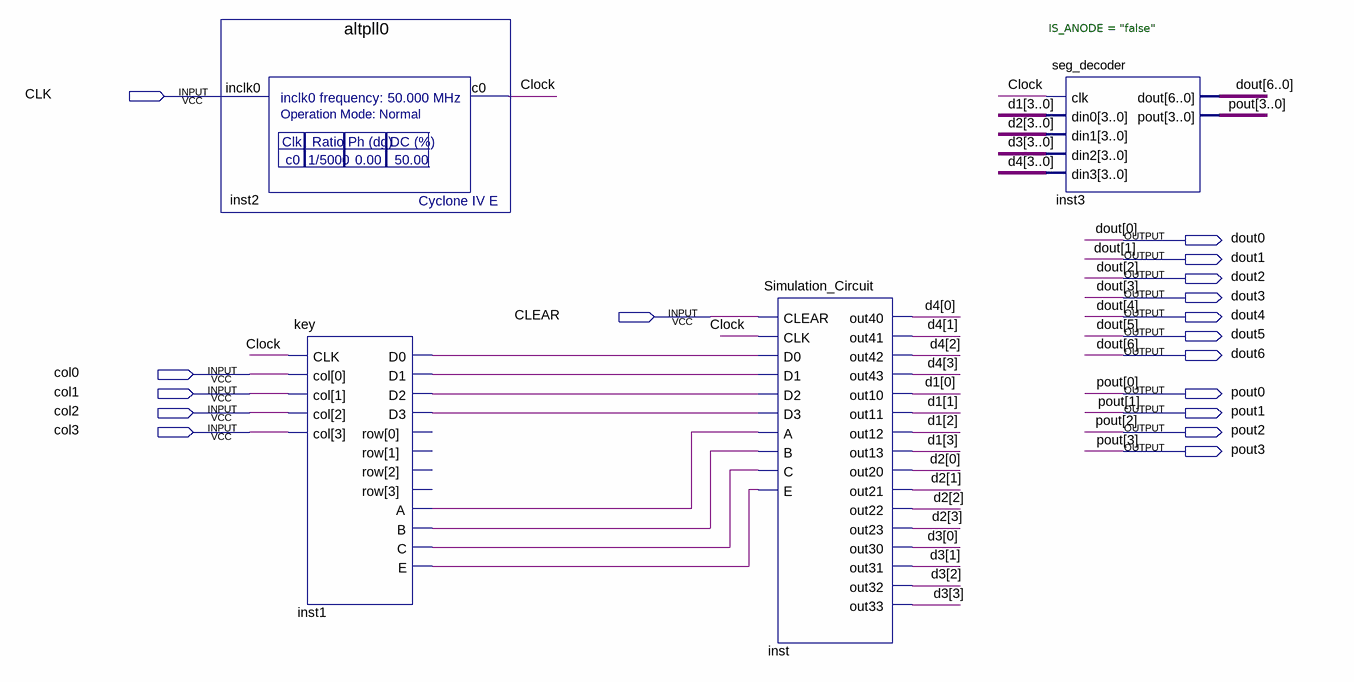
[diagram p0: schematic sheet]
// Quartus schematic Full_Calculator2.0.bdf as structural Verilog: 4 symbols, 17 pins
module \Full_Calculator2.0  (
  input  CLK,
  input  CLEAR,
  input  col0,
  input  col1,
  input  col2,
  input  col3,
  output dout0,
  output dout1,
  output dout2,
  output dout3,
  output dout4,
  output dout5,
  output dout6,
  output pout0,
  output pout1,
  output pout2,
  output pout3
);

  wire Clock, inst1_a, inst1_b, inst1_c, inst1_d0, inst1_d1, inst1_d2, inst1_d3, inst1_e;
  wire [3:0] d1, d2, d3, d4;

  altpll0 inst2 (.inclk0(CLK), .c0(Clock));
  key inst1 (
    .CLK(Clock), .col({col3, col2, col1, col0}), .D0(inst1_d0), .D1(inst1_d1), .D2(inst1_d2), .D3(inst1_d3),
    .A(inst1_a), .B(inst1_b), .C(inst1_c), .E(inst1_e));  // open: row
  Simulation_Circuit inst (
    .CLEAR(CLEAR), .CLK(Clock), .D0(inst1_d0), .D1(inst1_d1), .D2(inst1_d2), .D3(inst1_d3), .A(inst1_a),
    .B(inst1_b), .C(inst1_c), .E(inst1_e), .out40(d4[0]), .out41(d4[1]), .out42(d4[2]), .out43(d4[3]),
    .out10(d1[0]), .out11(d1[1]), .out12(d1[2]), .out13(d1[3]), .out20(d2[0]), .out21(d2[1]), .out22(d2[2]),
    .out23(d2[3]), .out30(d3[0]), .out31(d3[1]), .out32(d3[2]), .out33(d3[3]));
  seg_decoder #(.IS_ANODE("false")) inst3 (
    .clk(Clock), .din0(d1), .din1(d2), .din2(d3), .din3(d4),
    .dout({dout6, dout5, dout4, dout3, dout2, dout1, dout0}), .pout({pout3, pout2, pout1, pout0}));
endmodule
